# EAGLE design Dummy Bridge Board (EAGLE 7.3.0)
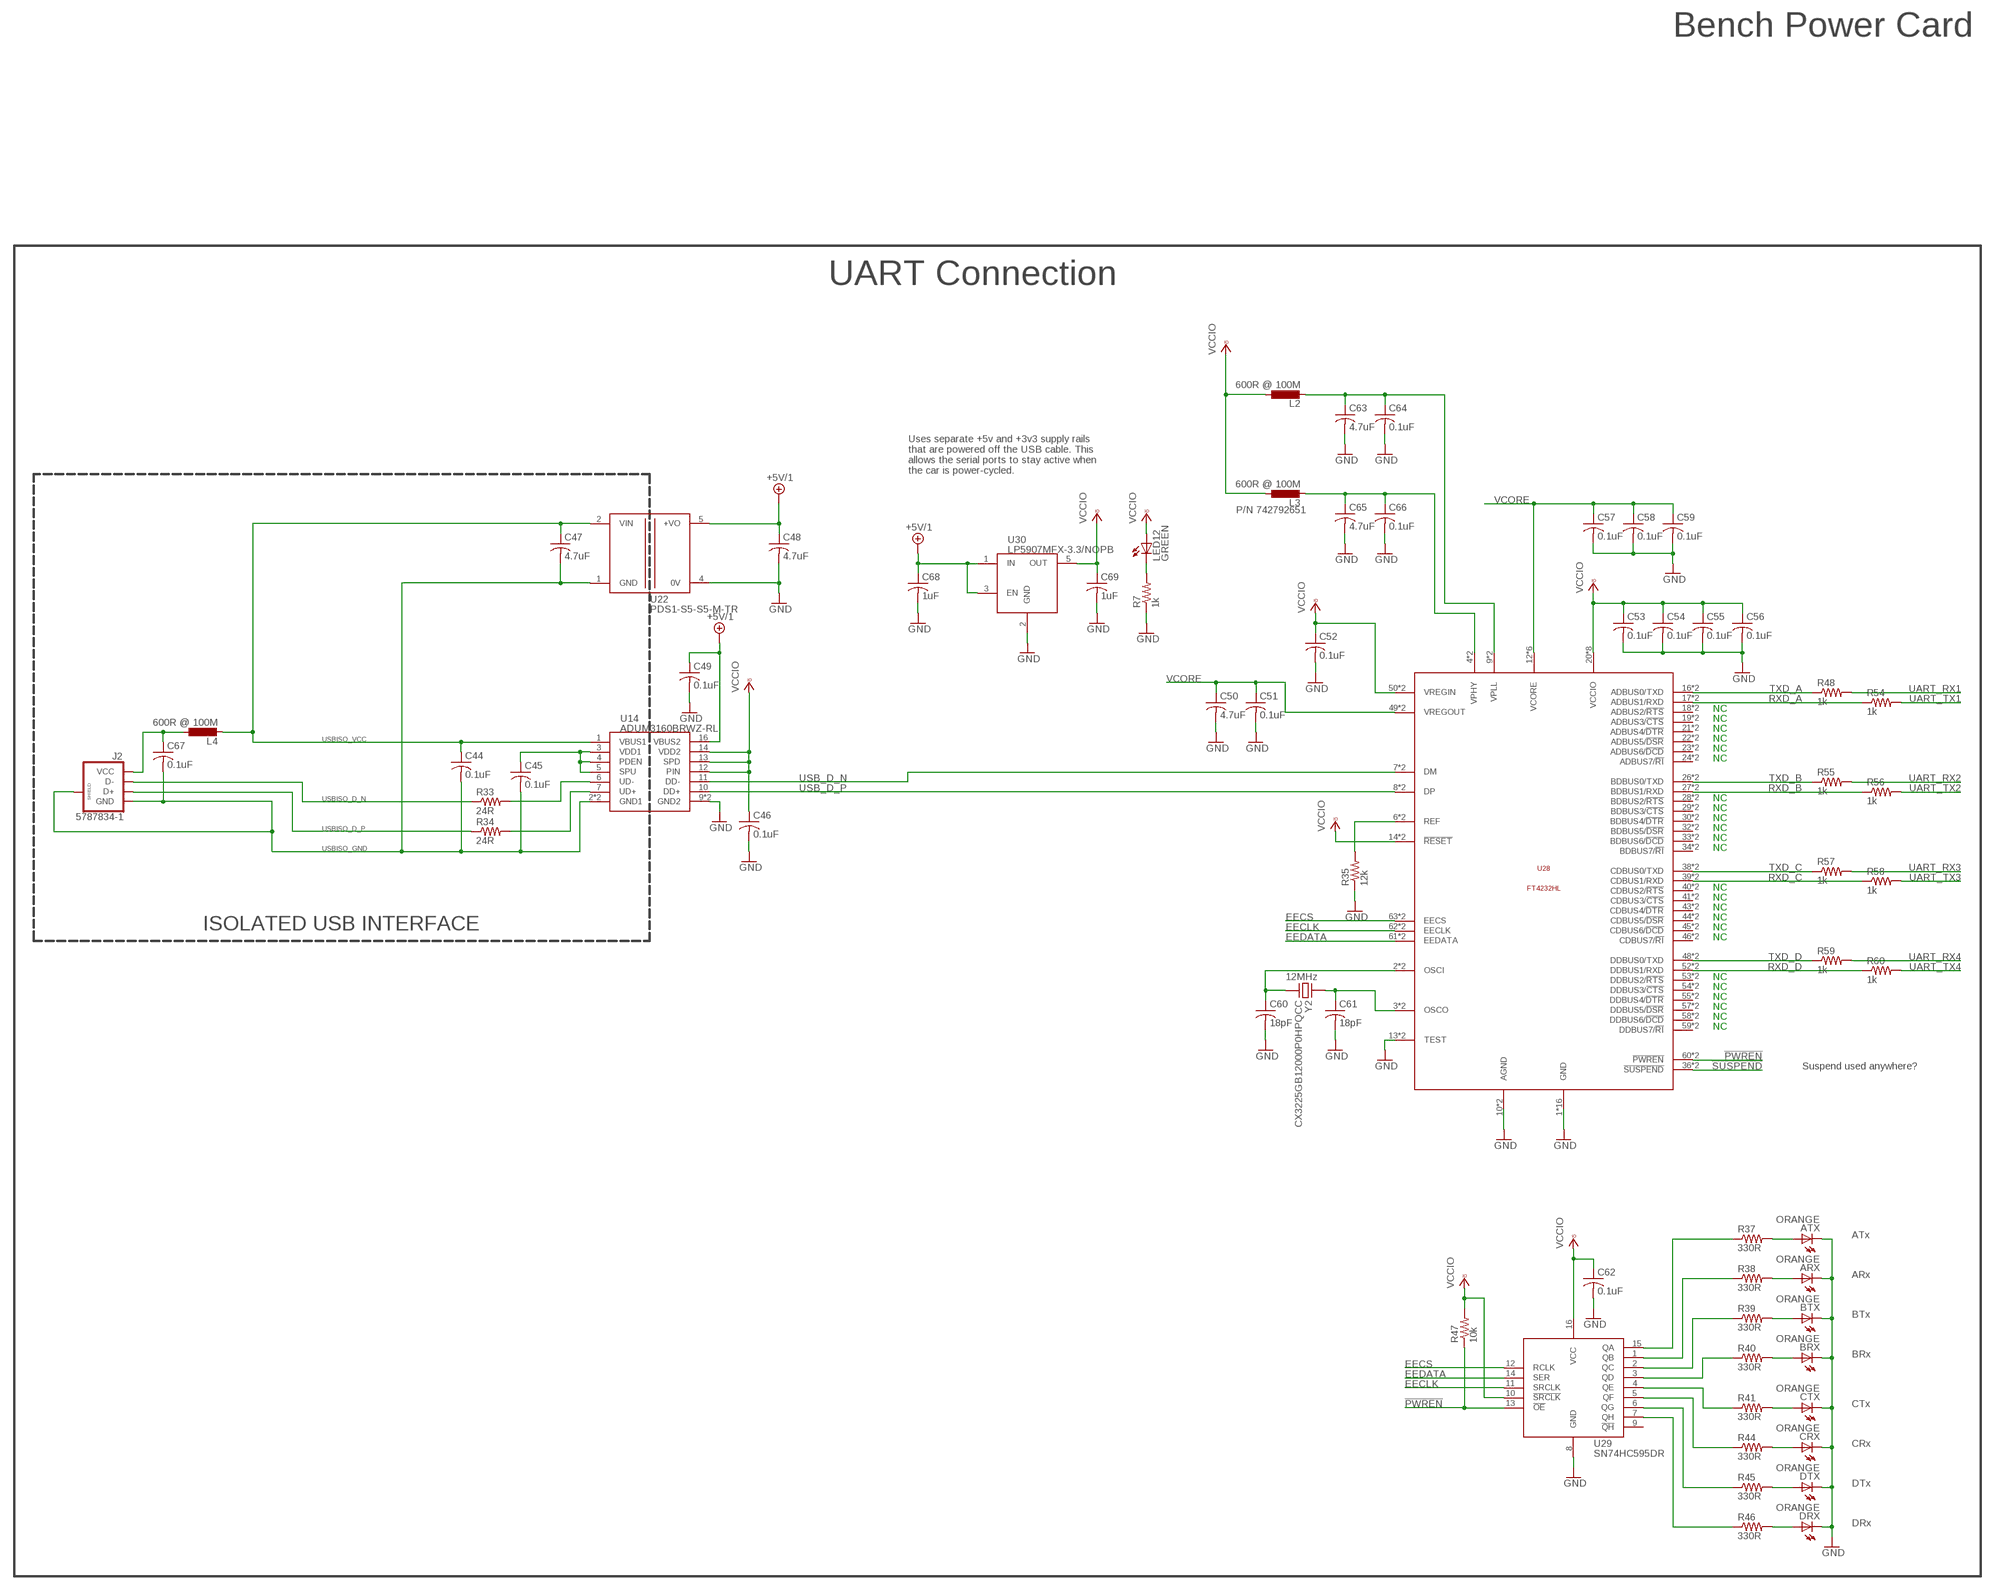
[diagram p0: schematic, sheet 1, part 1 of 2]
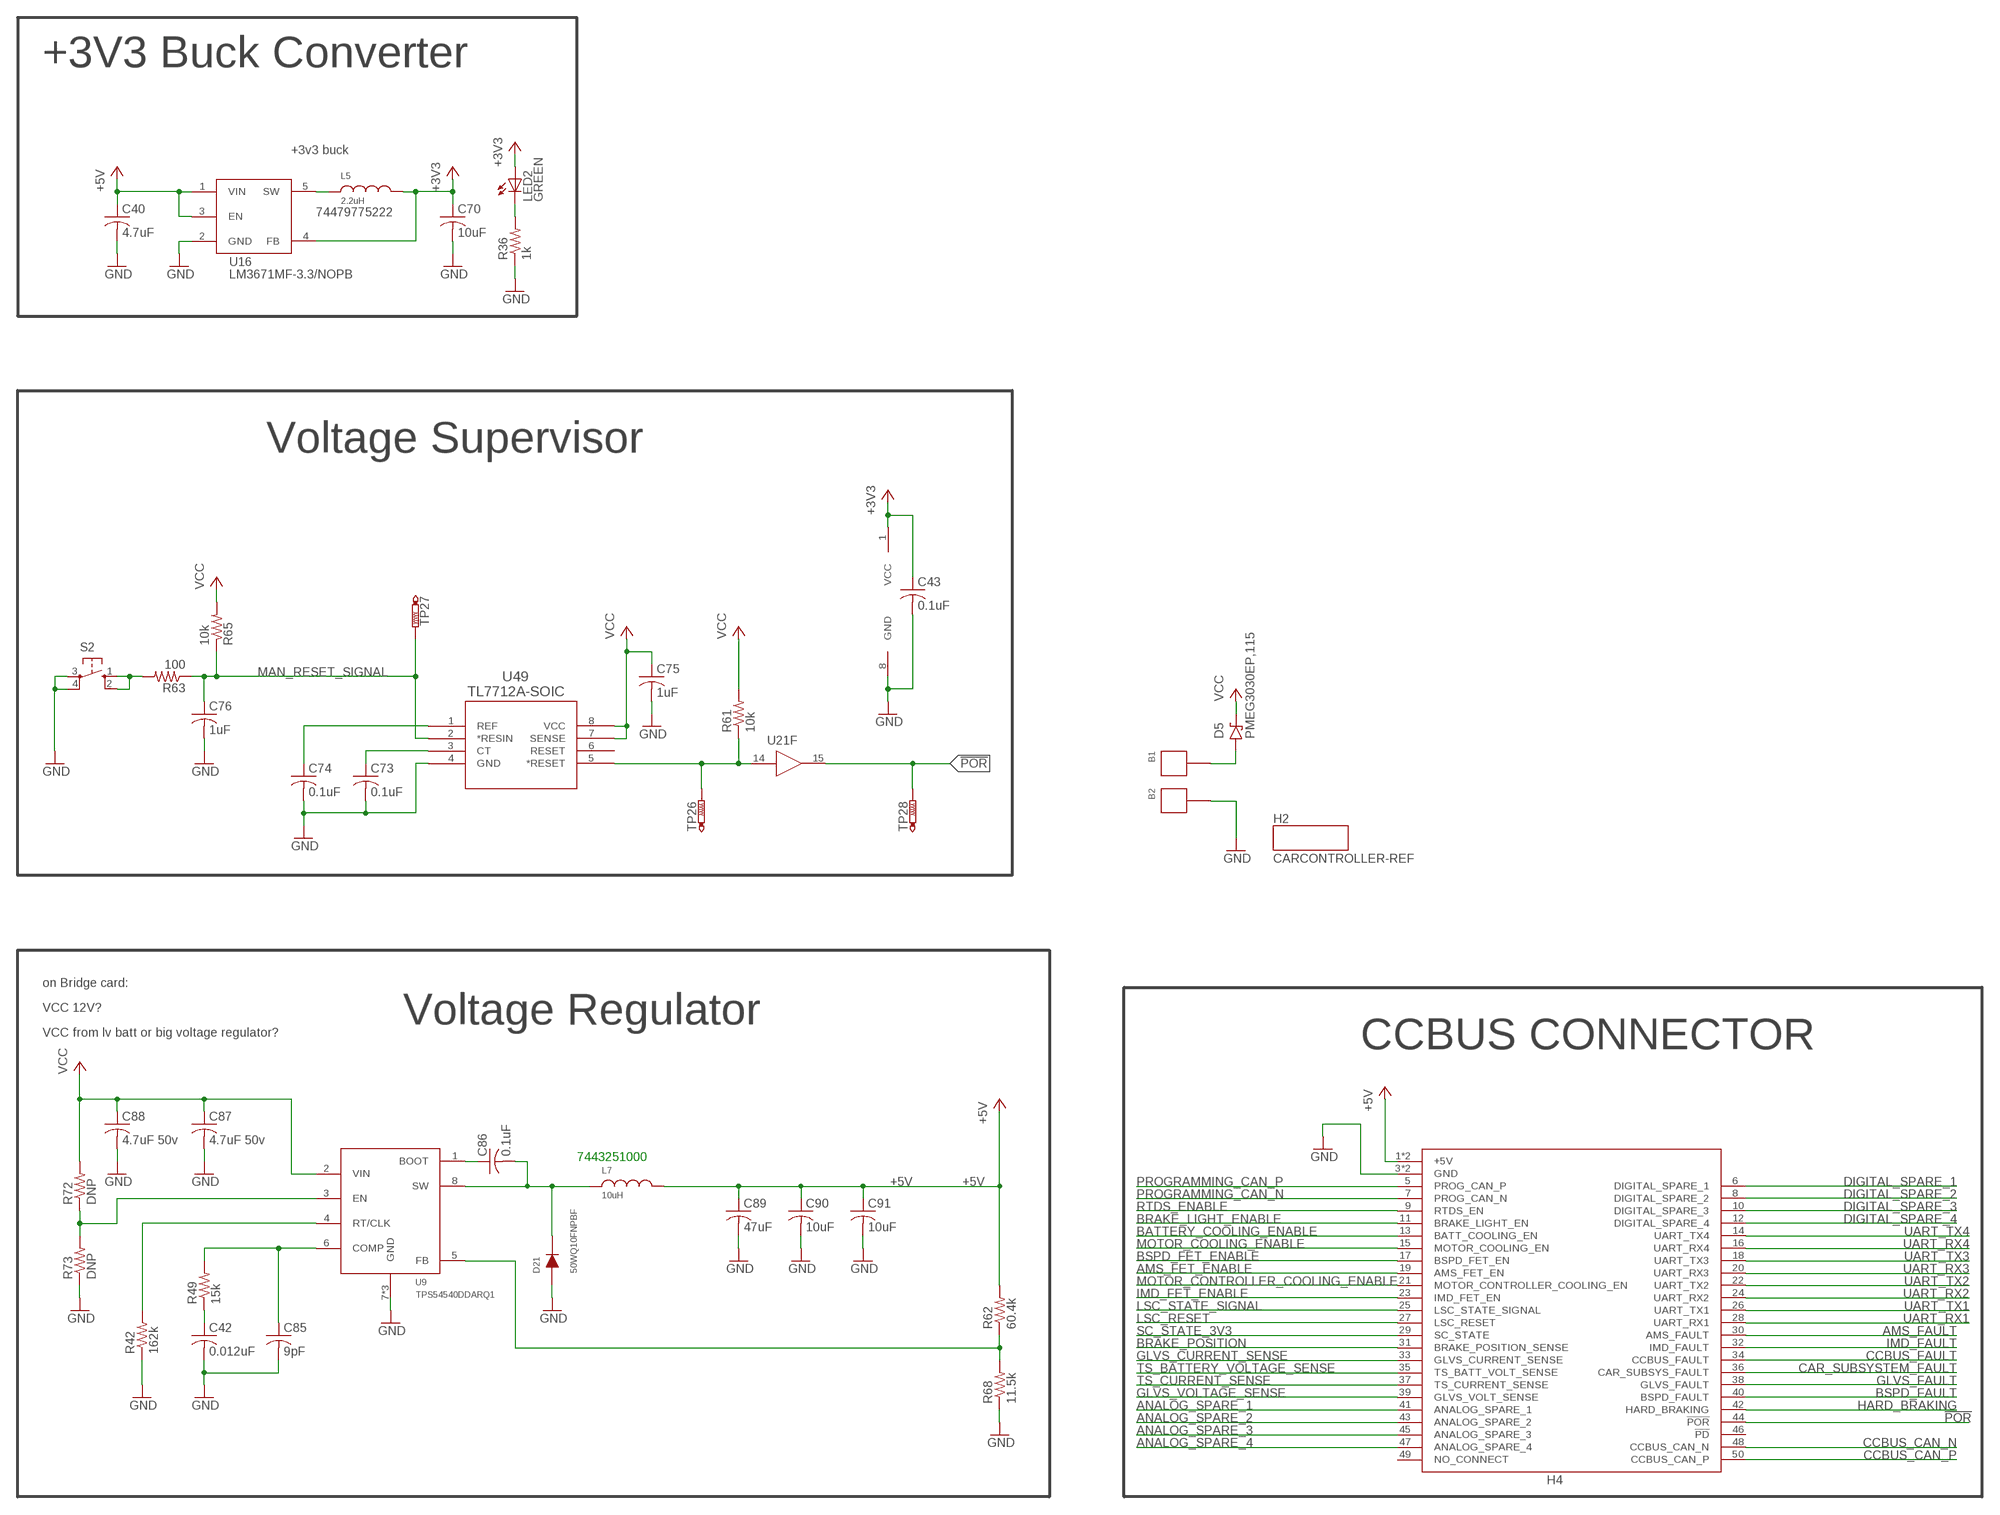
[diagram p1: schematic, sheet 1, part 2 of 2]

## Parts
ARX  ORANGE  LEDCHIP-LED0805  [CHIP-LED0805]
ATX  ORANGE  LEDCHIP-LED0805  [CHIP-LED0805]
B1  BKCT2228-2-ND  CT2228  [BANANA_SOCKET_VERT]
B2  BKCT2228-0-ND  CT2228  [BANANA_SOCKET_VERT]
BRX  ORANGE  LEDCHIP-LED0805  [CHIP-LED0805]
BTX  ORANGE  LEDCHIP-LED0805  [CHIP-LED0805]
C40  4.7uF  C-USC0603K  [C0603K]
C42  0.012uF  C-USC0603K  [C0603K]
C43  0.1uF  C-USC0603K  [C0603K]
C44  0.1uF  C-USC0603K  [C0603K]
C45  0.1uF  C-USC0603K  [C0603K]
C46  0.1uF  C-USC0603K  [C0603K]
C47  4.7uF  C-USC0603K  [C0603K]
C48  4.7uF  C-USC0603K  [C0603K]
C49  0.1uF  C-USC0603K  [C0603K]
C50  4.7uF  C-USC0603K  [C0603K]
C51  0.1uF  C-USC0603K  [C0603K]
C52  0.1uF  C-USC0603K  [C0603K]
C53  0.1uF  C-USC0603K  [C0603K]
C54  0.1uF  C-USC0603K  [C0603K]
C55  0.1uF  C-USC0603K  [C0603K]
C56  0.1uF  C-USC0603K  [C0603K]
C57  0.1uF  C-USC0603K  [C0603K]
C58  0.1uF  C-USC0603K  [C0603K]
C59  0.1uF  C-USC0603K  [C0603K]
C60  18pF  C-USC0603K  [C0603K]
C61  18pF  C-USC0603K  [C0603K]
C62  0.1uF  C-USC0603K  [C0603K]
C63  4.7uF  C-USC0603K  [C0603K]
C64  0.1uF  C-USC0603K  [C0603K]
C65  4.7uF  C-USC0603K  [C0603K]
C66  0.1uF  C-USC0603K  [C0603K]
C67  0.1uF  C-USC0603K  [C0603K]
C68  1uF  C-USC0603K  [C0603K]
C69  1uF  C-USC0603K  [C0603K]
C70  10uF  C-USC0603K  [C0603K]
C73  0.1uF  C-USC0603K  [C0603K]
C74  0.1uF  C-USC0603K  [C0603K]
C75  1uF  C-USC0603K  [C0603K]
C76  1uF  C-USC0603K  [C0603K]
C85  9pF  C-USC0603K  [C0603K]
C86  0.1uF  C-USC0603K  [C0603K]
C87  4.7uF 50v  C-USC1206  [C1206]
C88  4.7uF 50v  C-USC1206  [C1206]
C89  47uF  C-USC1206  [C1206]
C90  10uF  C-USC0603K  [C0603K]
C91  10uF  C-USC0603K  [C0603K]
CRX  ORANGE  LEDCHIP-LED0805  [CHIP-LED0805]
CTX  ORANGE  LEDCHIP-LED0805  [CHIP-LED0805]
D5  PMEG3030EP,115  [SOD-128]
D21  50WQ10FNPBF  VISHAY-50WQ10FNPBF  [DPAK]
DRX  ORANGE  LEDCHIP-LED0805  [CHIP-LED0805]
DTX  ORANGE  LEDCHIP-LED0805  [CHIP-LED0805]
H2  CARCONTROLLER-REF  [CARCONTROLLER-REF]
H4  CCBUS-STACK  [SAMTEC-TFM-125-XX-X-D]
J2  5787834-1  TE-USB-B-5787834-1  [TE-5787834-1]
L2  600R @ 100M  INDUCTOR  [0805]
L3  600R @ 100M  INDUCTOR  [0805]
L4  600R @ 100M  INDUCTOR  [0805]
L5  2.2uH  L0805  [0805]
L7  10uH  WURTH-744325XXXX  [WURTH-744325XXXX]
LED2  GREEN  LEDCHIP-LED0805  [CHIP-LED0805]
LED12  GREEN  LEDCHIP-LED0805  [CHIP-LED0805]
R7  1k  R-US_R0603  [R0603]
R33  24R  R-US_R0603  [R0603]
R34  24R  R-US_R0603  [R0603]
R35  12k  R-US_R0603  [R0603]
R36  1k  R-US_R0603  [R0603]
R37  330R  R-US_R0603  [R0603]
R38  330R  R-US_R0603  [R0603]
R39  330R  R-US_R0603  [R0603]
R40  330R  R-US_R0603  [R0603]
R41  330R  R-US_R0603  [R0603]
R42  162k  R-US_R0603  [R0603]
R44  330R  R-US_R0603  [R0603]
R45  330R  R-US_R0603  [R0603]
R46  330R  R-US_R0603  [R0603]
R47  10k  R-US_R0603  [R0603]
R48  1k  R-US_R0603  [R0603]
R49  15k  R-US_R0603  [R0603]
R54  1k  R-US_R0603  [R0603]
R55  1k  R-US_R0603  [R0603]
R56  1k  R-US_R0603  [R0603]
R57  1k  R-US_R0603  [R0603]
R58  1k  R-US_R0603  [R0603]
R59  1k  R-US_R0603  [R0603]
R60  1k  R-US_R0603  [R0603]
R61  10k  R-US_R0603  [R0603]
R62  60.4k  R-US_R0603  [R0603]
R63  100  R-US_R0603  [R0603]
R65  10k  R-US_R0603  [R0603]
R68  11.5k  R-US_R0603  [R0603]
R72  DNP  R-US_R0603  [R0603]
R73  DNP  R-US_R0603  [R0603]
S2  TE-FSM4JSMATR  [TE-FSM4JSMATR]
TP26  PTR1TP20R  [TP20R]
TP27  PTR1TP20R  [TP20R]
TP28  PTR1TP20R  [TP20R]
U9  TPS54540DDARQ1  TPS54540  [TPS54540]
U14  ADUM3160BRWZ-RL  ADUM3160  [ADUM3160]
U16  LM3671MF-3.3/NOPB  LM3671MF  [SOT23-5]
U21  CD4050BD  [SOIC-16]
U22  PDS1-S5-S5-M-TR  PDS1-M  [PDS1-M]
U28  FT4232HL  [PQFP-64]
U29  SN74HC595DR  SN74HC595D  [SOIC-16]
U30  LP5907MFX-3.3/NOPB  LP5907MFX  [SOT23-5]
U49  TL7712A-SOIC  TL7709A-SOIC  [D8]
Y2  CX3225GB12000P0HPQCC  CX3225GB  [CX3225GB]

## Nets
5VREG_EN: R72.1 R73.2 U9.3(EN)
!POR: H4.44(!POR!) TP28.TP U21.15(F:OUT)
!PWREN!: R47.1 U28.60(!PWREN!) U28.MASK-60(!PWREN!) U29.13(!OE!)
!SUSPEND!: U28.36(!SUSPEND!) U28.MASK-36(!SUSPEND!)
+3V3: C43.1 C70.1 L5.2 LED2.A U16.4(FB) U21.1(POWER:VCC)
+5V: C40.1 C89.1 C90.1 C91.1 H4.1(+5V) H4.2(+5V) L7.P$2 R62.2 U16.1(VIN) U16.3(EN)
+5V/1: C48.1 C49.1 C68.1 U14.16(VBUS2) U22.5(+VO) U30.1(IN) U30.3(EN)
AMS_FAULT: H4.30(AMS_FAULT)
AMS_FET_ENABLE: H4.19(AMS_FET_EN)
ANALOG_SPARE_1: H4.41(ANALOG_SPARE_1)
ANALOG_SPARE_2: H4.43(ANALOG_SPARE_2)
ANALOG_SPARE_3: H4.45(ANALOG_SPARE_3)
ANALOG_SPARE_4: H4.47(ANALOG_SPARE_4)
BATTERY_COOLING_ENABLE: H4.13(BATT_COOLING_EN)
BOOT_5V: C86.1 U9.1(BOOT)
BRAKE_LIGHT_ENABLE: H4.11(BRAKE_LIGHT_EN)
BRAKE_POSITION [analog]: H4.31(BRAKE_POSITION_SENSE)
BSPD_FAULT: H4.40(BSPD_FAULT)
BSPD_FET_ENABLE: H4.17(BSPD_FET_EN)
CAR_SUBSYSTEM_FAULT: H4.36(CAR_SUBSYS_FAULT)
CCBUS_CAN_N [diffPairs]: H4.48(CCBUS_CAN_N)
CCBUS_CAN_P [diffPairs]: H4.50(CCBUS_CAN_P)
CCBUS_FAULT: H4.34(CCBUS_FAULT)
COMP_5V: C85.1 R49.2 U9.6(COMP)
DIGITAL_SPARE_1: H4.6(DIGITAL_SPARE_1)
DIGITAL_SPARE_2: H4.8(DIGITAL_SPARE_2)
DIGITAL_SPARE_3: H4.10(DIGITAL_SPARE_3)
DIGITAL_SPARE_4: H4.12(DIGITAL_SPARE_4)
EECLK: U28.62(EECLK) U28.MASK-62(EECLK) U29.11(SRCLK)
EECS: U28.63(EECS) U28.MASK-63(EECS) U29.12(RCLK)
EEDATA: U28.61(EEDATA) U28.MASK-61(EEDATA) U29.14(SER)
FB_5V: R62.1 R68.2 U9.5(FB)
GLVS_CURRENT_SENSE: H4.33(GLVS_CURRENT_SENSE)
GLVS_FAULT: H4.38(GLVS_FAULT)
GLVS_VOLTAGE_SENSE [analog]: H4.39(GLVS_VOLT_SENSE)
GND: ARX.C ATX.C B2.P$1 BRX.C BTX.C C40.2 C42.2 C43.2 C46.2 C48.2 C49.2 C50.2 C51.2 C52.2 C53.2 C54.2 C55.2 C56.2 C57.2 C58.2 C59.2 C60.2 C61.2 C62.2 C63.2 C64.2 C65.2 C66.2 C68.2 C69.2 C70.2 C73.2 C74.2 C75.2 C76.2 C85.2 C87.2 C88.2 C89.2 C90.2 C91.2 CRX.C CTX.C D21.1(ANODE) D21.3(ANODE) DRX.C DTX.C H4.3(GND) H4.4(GND) R7.1 R35.1 R36.1 R42.1 R68.1 R73.1 S2.3 S2.4 U9.7(GND) U9.PAD1(GND) U9.PAD(GND) U14.9(GND2) U14.15(GND2) U16.2(GND) U21.8(POWER:GND) U22.4(0V) U28.1(GND) U28.5(GND) U28.10(AGND) U28.11(GND) U28.13(TEST) U28.15(GND) U28.25(GND) U28.35(GND) U28.47(GND) U28.51(GND) U28.MASK-1(GND) U28.MASK-5(GND) U28.MASK-10(AGND) U28.MASK-11(GND) U28.MASK-13(TEST) U28.MASK-15(GND) U28.MASK-25(GND) U28.MASK-35(GND) U28.MASK-47(GND) U28.MASK-51(GND) U29.8(GND) U30.2(GND) U49.4(GND)
HARD_BRAKING: H4.42(HARD_BRAKING)
IMD_FAULT: H4.32(IMD_FAULT)
IMD_FET_ENABLE: H4.23(IMD_FET_EN)
LSC_RESET: H4.27(LSC_RESET)
LSC_STATE_SIGNAL: H4.25(LSC_STATE_SIGNAL)
MAN_RESET_SIGNAL: C76.1 R63.1 R65.1 TP27.TP U49.2(*RESIN)
MOTOR_CONTROLLER_COOLING_ENABLE: H4.21(MOTOR_CONTROLLER_COOLING_EN)
MOTOR_COOLING_ENABLE: H4.15(MOTOR_COOLING_EN)
N$2: B1.P$1 D5.ANODE(A)
N$4: LED12.C R7.2
N$17: C42.1 R49.1
N$32: R40.1 U29.3(QD)
N$47: R41.1 U29.4(QE)
N$49: R39.1 U29.2(QC)
N$50: R38.1 U29.1(QB)
N$52: R37.1 U29.15(QA)
N$55: R44.1 U29.5(QF)
N$56: LED2.C R36.2
N$57: L5.1 U16.5(SW)
N$60: R61.1 TP26.TP U21.14(F:IN) U49.5(*RESET)
N$61: R45.1 U29.6(QG)
N$62: R46.1 U29.7(QH)
N$63: ATX.A R37.2
N$64: ARX.A R38.2
N$65: BTX.A R39.2
N$66: BRX.A R40.2
N$67: CTX.A R41.2
N$68: CRX.A R44.2
N$69: DTX.A R45.2
N$70: DRX.A R46.2
N$71: C67.1 J2.1(VCC) L4.1
N$72: C74.1 U49.1(REF)
N$73: C73.1 U49.3(CT)
N$74: R63.2 S2.1 S2.2
OSCI: C60.1 U28.2(OSCI) U28.MASK-2(OSCI) Y2.3
OSCO: C61.1 U28.3(OSCO) U28.MASK-3(OSCO) Y2.1
PROGRAMMING_CAN_N: H4.7(PROG_CAN_N)
PROGRAMMING_CAN_P: H4.5(PROG_CAN_P)
REF: R35.2 U28.6(REF) U28.MASK-6(REF)
RT_5V: R42.2 U9.4(RT/CLK)
RTDS_ENABLE: H4.9(RTDS_EN)
RXD_A: R54.1 U28.17(ADBUS1/RXD) U28.MASK-17(ADBUS1/RXD)
RXD_B: R56.1 U28.27(BDBUS1/RXD) U28.MASK-27(BDBUS1/RXD)
RXD_C: R58.1 U28.39(CDBUS1/RXD) U28.MASK-39(CDBUS1/RXD)
RXD_D: R60.1 U28.52(DDBUS1/RXD) U28.MASK-52(DDBUS1/RXD)
SC_STATE_3V3: H4.29(SC_STATE)
SW_5V: C86.2 D21.2(CATHODE) L7.P$1 U9.8(SW)
TS_BATTERY_VOLTAGE_SENSE: H4.35(TS_BATT_VOLT_SENSE)
TS_CURRENT_SENSE [analog]: H4.37(TS_CURRENT_SENSE)
TXD_A: R48.1 U28.16(ADBUS0/TXD) U28.MASK-16(ADBUS0/TXD)
TXD_B: R55.1 U28.26(BDBUS0/TXD) U28.MASK-26(BDBUS0/TXD)
TXD_C: R57.1 U28.38(CDBUS0/TXD) U28.MASK-38(CDBUS0/TXD)
TXD_D: R59.1 U28.48(DDBUS0/TXD) U28.MASK-48(DDBUS0/TXD)
UART_RX1: H4.28(UART_RX1) R48.2
UART_RX2: H4.24(UART_RX2) R55.2
UART_RX3: H4.20(UART_RX3) R57.2
UART_RX4: H4.16(UART_RX4) R59.2
UART_TX1: H4.26(UART_TX1) R54.2
UART_TX2: H4.22(UART_TX2) R56.2
UART_TX3: H4.18(UART_TX3) R58.2
UART_TX4: H4.14(UART_TX4) R60.2
UD_N [USB]: R33.2 U14.6(UD-)
UD_P [USB]: R34.2 U14.7(UD+)
USB_D_N [USB]: U14.11(DD-) U28.7(DM) U28.MASK-7(DM)
USB_D_P [USB]: U14.10(DD+) U28.8(DP) U28.MASK-8(DP)
USBISO_D_N [USB]: J2.2(D-) R33.1
USBISO_D_P [USB]: J2.3(D+) R34.1
USBISO_GND: C44.2 C45.2 C47.2 C67.2 J2.4(GND) J2.SH1(SHIELD) J2.SH2(SHIELD) U14.2(GND1) U14.8(GND1) U22.1(GND)
USBISO_VCC: C44.1 C47.1 L4.2 U14.1(VBUS1) U22.2(VIN)
VCC: C75.1 C87.1 C88.1 D5.CATHODE(K) R61.2 R65.2 R72.2 U9.2(VIN) U49.7(SENSE) U49.8(VCC)
VCCIO: C46.1 C52.1 C53.1 C54.1 C55.1 C56.1 C62.1 C69.1 L2.1 L3.1 LED12.A R47.2 U14.12(PIN) U14.13(SPD) U14.14(VDD2) U28.14(!RESET!) U28.20(VCCIO) U28.31(VCCIO) U28.42(VCCIO) U28.50(VREGIN) U28.56(VCCIO) U28.MASK-14(!RESET!) U28.MASK-20(VCCIO) U28.MASK-31(VCCIO) U28.MASK-42(VCCIO) U28.MASK-50(VREGIN) U28.MASK-56(VCCIO) U29.10(!SRCLK!) U29.16(VCC) U30.5(OUT)
VCORE: C50.1 C51.1 C57.1 C58.1 C59.1 U28.12(VCORE) U28.37(VCORE) U28.49(VREGOUT) U28.64(VCORE) U28.MASK-12(VCORE) U28.MASK-37(VCORE) U28.MASK-49(VREGOUT) U28.MASK-64(VCORE)
VDD1: C45.1 U14.3(VDD1) U14.4(PDEN) U14.5(SPU)
VPHY: C65.1 C66.1 L3.2 U28.4(VPHY) U28.MASK-4(VPHY)
VPLL: C63.1 C64.1 L2.2 U28.9(VPLL) U28.MASK-9(VPLL)
Unconnected: H4.46(!PD!) H4.49(NO_CONNECT) U21.2(A:OUT) U21.3(A:IN) U21.4(B:OUT) U21.5(B:IN) U21.6(C:OUT) U21.7(C:IN) U21.9(D:IN) U21.10(D:OUT) U21.11(E:IN) U21.12(E:OUT) U28.18(ADBUS2/!RTS!) U28.19(ADBUS3/!CTS!) U28.21(ADBUS4/!DTR!) U28.22(ADBUS5/!DSR!) U28.23(ADBUS6/!DCD!) U28.24(ADBUS7/!RI!) U28.28(BDBUS2/!RTS!) U28.29(BDBUS3/!CTS!) U28.30(BDBUS4/!DTR!) U28.32(BDBUS5/!DSR!) U28.33(BDBUS6/!DCD!) U28.34(BDBUS7/!RI!) U28.40(CDBUS2/!RTS!) U28.41(CDBUS3/!CTS!) U28.43(CDBUS4/!DTR!) U28.44(CDBUS5/!DSR!) U28.45(CDBUS6/!DCD!) U28.46(CDBUS7/!RI!) U28.53(DDBUS2/!RTS!) U28.54(DDBUS3/!CTS!) U28.55(DDBUS4/!DTR!) U28.57(DDBUS5/!DSR!) U28.58(DDBUS6/!DCD!) U28.59(DDBUS7/!RI!) U28.MASK-18(ADBUS2/!RTS!) U28.MASK-19(ADBUS3/!CTS!) U28.MASK-21(ADBUS4/!DTR!) U28.MASK-22(ADBUS5/!DSR!) U28.MASK-23(ADBUS6/!DCD!) U28.MASK-24(ADBUS7/!RI!) U28.MASK-28(BDBUS2/!RTS!) U28.MASK-29(BDBUS3/!CTS!) U28.MASK-30(BDBUS4/!DTR!) U28.MASK-32(BDBUS5/!DSR!) U28.MASK-33(BDBUS6/!DCD!) U28.MASK-34(BDBUS7/!RI!) U28.MASK-40(CDBUS2/!RTS!) U28.MASK-41(CDBUS3/!CTS!) U28.MASK-43(CDBUS4/!DTR!) U28.MASK-44(CDBUS5/!DSR!) U28.MASK-45(CDBUS6/!DCD!) U28.MASK-46(CDBUS7/!RI!) U28.MASK-53(DDBUS2/!RTS!) U28.MASK-54(DDBUS3/!CTS!) U28.MASK-55(DDBUS4/!DTR!) U28.MASK-57(DDBUS5/!DSR!) U28.MASK-58(DDBUS6/!DCD!) U28.MASK-59(DDBUS7/!RI!) U29.9(!QH!) U49.6(RESET)

## Notes on the sheet
- Bench Power Card
- UART Connection
- +3V3 Buck Converter
- Uses separate +5v and +3v3 supply rails
  that are powered off the USB cable. This
  allows the serial ports to stay active when
  the car is power-cycled.
- +3v3 buck
- P/N 742792651
- 74479775222
- NC
- NC
- NC
- NC | Voltage Supervisor
- NC
- NC
- NC
- NC
- NC
- NC
- NC
- NC
- NC
- NC
- NC
- NC
- ISOLATED USB INTERFACE | NC
- NC
- 12MHz | NC
- NC
- NC
- NC
- NC
- NC
- Suspend used anywhere?
- on Bridge card:
- VCC 12V?
- Voltage Regulator
- VCC from lv batt or big voltage regulator?
- CCBUS CONNECTOR
- ATx
- ARx
- 7443251000
- BTx
- BRx
- CTx
- CRx
- DTx
- DRx

## Library data of the parts
ARX ATX BRX BTX CRX CTX DRX DTX = FormE:LED: LED OSRAM: - CHIPLED LG R971, LG N971, LY N971, LG Q971, LY Q971, LO R971, LY R971 LH N974, LH R974 LS Q976, LO Q976, LY Q976 LO Q996 - Hyper CHIPLED LW Q18S LB Q993, LB Q99A, LB R99A - SideLED LS A670, LO A670, LY A670, LG A670, LP A670 LB A673, LV A673, LT A673, LW A673 LH A674 LY A675 LS A676, LA A676, LO A676, LY A676, LW A676 LS A679, LY A679, LG A679 - Hyper Micro SIDELED® LS Y876, LA Y876, LO Y876, LY Y876 LT Y87S - SmartLED LW L88C, LW L88S LB L89C, LB L89S, LG L890 LS L89K, LO L89K, LY L89K LS L896, LA L896, LO L896, LY L896 - TOPLED LS T670, LO T670, LY T670, LG T670, LP T670 LSG T670, LSP T670, LSY T670, LOP T670, LYG T670 LG T671, LOG T671, LSG T671 LB T673, LV T673, LT T673, LW T673 LH T674 LS T676, LA T676, LO T676, LY T676, LB T676, LH T676, LSB T676, LW T676 LB T67C, LV T67C, LT T67C, LS T67K, LO T67K, LY T67K, LW E67C LS E67B, LA E67B, LO E67B, LY E67B, LB E67C, LV E67C, LT E67C LW T67C LS T679, LY T679, LG T679 LS T770, LO T770, LY T770, LG T770, LP T770 LB T773, LV T773, LT T773, LW T773 LH T774 LS E675, LA E675, LY E675, LS T675 LS T776, LA T776, LO T776, LY T776, LB T776 LHGB T686 LT T68C, LB T68C - Hyper Mini TOPLED® LB M676 - Mini TOPLED Santana® LG M470 LS M47K, LO M47K, LY M47K Source: http://www.osram.convergy.de/; PARTNO: 598-8130-107F
B1 = FormE:CT2228: BANANA SOCKET VERT; PARTNO: CT2228-2
B2 = FormE:CT2228: BANANA SOCKET VERT; PARTNO: CT2228-0
C40 = rcl:C-US: CAPACITOR, American symbol; PARTNO: GRM188R61A475KE15D
C42 = rcl:C-US: CAPACITOR, American symbol; PARTNO: GRM188R71H123KA01D
C43-C46 C49 C51-C59 C62 C64 C66-C69 C75 C76 C86 = rcl:C-US: CAPACITOR, American symbol; PARTNO: GRM188R71E104KA01D
C47 C48 C50 C63 C65 = rcl:C-US: CAPACITOR, American symbol; PARTNO: GRM188R61C475KAAJD
C60 C61 = rcl:C-US: CAPACITOR, American symbol; PARTNO: GRM1885C1H180JA01D
C70 C90 C91 = rcl:C-US: CAPACITOR, American symbol; PARTNO: EMK107BBJ106MA-T
C73 C74 = rcl:C-US: CAPACITOR, American symbol; MPN: C2012X7R1H104K085AA; OC_NEWARK: 04X3288; PARTNO: GRM188R71E104KA01D
C85 = rcl:C-US: CAPACITOR, American symbol; PARTNO: GRM1885C1H9R0DA01D
C87 C88 = rcl:C-US: CAPACITOR, American symbol; PARTNO: GRM31CR71H475KA12L
C89 = rcl:C-US: CAPACITOR, American symbol; PARTNO: GRM31CR61A476ME15L
D5 = FormE:PMEG3030EP,115; PARTNO: PMEG3030EP,115
D21 = FormE:VISHAY-50WQ10FNPBF; PARTNO: VS-50WQ10FNPBF
H2 = FormE:CARCONTROLLER-REF
H4 = FormE:CCBUS-STACK
J2 = FormE:TE-USB-B-5787834-1; PARTNO: 5787834-1; VALUE: 5787834-1
L2-L4 = launchpad:INDUCTOR; PARTNO: BLM21AG601SN1D
L5 = FormE:L0805; PARTNO: 74479775222
L7 = FormE:WURTH-744325XXXX; PARTNO: 7443251000
LED2 LED12 = FormE:LED: LED OSRAM: - CHIPLED LG R971, LG N971, LY N971, LG Q971, LY Q971, LO R971, LY R971 LH N974, LH R974 LS Q976, LO Q976, LY Q976 LO Q996 - Hyper CHIPLED LW Q18S LB Q993, LB Q99A, LB R99A - SideLED LS A670, LO A670, LY A670, LG A670, LP A670 LB A673, LV A673, LT A673, LW A673 LH A674 LY A675 LS A676, LA A676, LO A676, LY A676, LW A676 LS A679, LY A679, LG A679 - Hyper Micro SIDELED® LS Y876, LA Y876, LO Y876, LY Y876 LT Y87S - SmartLED LW L88C, LW L88S LB L89C, LB L89S, LG L890 LS L89K, LO L89K, LY L89K LS L896, LA L896, LO L896, LY L896 - TOPLED LS T670, LO T670, LY T670, LG T670, LP T670 LSG T670, LSP T670, LSY T670, LOP T670, LYG T670 LG T671, LOG T671, LSG T671 LB T673, LV T673, LT T673, LW T673 LH T674 LS T676, LA T676, LO T676, LY T676, LB T676, LH T676, LSB T676, LW T676 LB T67C, LV T67C, LT T67C, LS T67K, LO T67K, LY T67K, LW E67C LS E67B, LA E67B, LO E67B, LY E67B, LB E67C, LV E67C, LT E67C LW T67C LS T679, LY T679, LG T679 LS T770, LO T770, LY T770, LG T770, LP T770 LB T773, LV T773, LT T773, LW T773 LH T774 LS E675, LA E675, LY E675, LS T675 LS T776, LA T776, LO T776, LY T776, LB T776 LHGB T686 LT T68C, LB T68C - Hyper Mini TOPLED® LB M676 - Mini TOPLED Santana® LG M470 LS M47K, LO M47K, LY M47K Source: http://www.osram.convergy.de/; PARTNO: 598-8170-107F
R7 R36 R48 R54-R60 = rcl:R-US_: RESISTOR, American symbol; PARTNO: ERJ-3EKF1001V
R33 R34 = rcl:R-US_: RESISTOR, American symbol; PARTNO: ERJ-3EKF24R0V
R35 = rcl:R-US_: RESISTOR, American symbol; PARTNO: ERJ-3EKF1202V
R37-R41 R44-R46 = rcl:R-US_: RESISTOR, American symbol; PARTNO: ERJ-3EKF3300V
R42 = rcl:R-US_: RESISTOR, American symbol; PARTNO: ERJ-3EKF1623V
R47 R61 R65 = rcl:R-US_: RESISTOR, American symbol; PARTNO: ERJ-3EKF1002V
R49 = rcl:R-US_: RESISTOR, American symbol; PARTNO: ERJ-3EKF1502V
R62 = rcl:R-US_: RESISTOR, American symbol; PARTNO: ERJ-3EKF6042V
R63 = rcl:R-US_: RESISTOR, American symbol; PARTNO: ERJ-3EKF1000V
R68 = rcl:R-US_: RESISTOR, American symbol; PARTNO: ERJ-3EKF1152V
R72 R73 = rcl:R-US_: RESISTOR, American symbol; PARTNO: *
S2 = FormE:TE-FSM4JSMATR; PARTNO: FSM4JSMATR
TP26-TP28 = testpad:PTR1: TEST PIN
U9 = FormE:TPS54540; PARTNO: TPS54540DDAR
U14 = FormE:ADUM3160; PARTNO: ADUM3160BRWZ-RL
U16 = FormE:LM3671; PARTNO: LM3671MF-3.3/NOPB
U21 = FormE:CD4050B; PARTNO: CD4050BDR
U22 = FormE:PDS1-M; PARTNO: PDS1-S5-S5-M-TR
U28 = FormE:FT4232H; PARTNO: FT4232HL-REEL
U29 = FormE:SN74HC595; PARTNO: SN74HC595DR
U30 = FormE:LP5907; PARTNO: LP5907MFX-3.3/NOPB
U49 = FormE:TL7709A; DATASHEETURL: http://www.ti.com/lit/gpn/TL7709A; DESCRIPTION: Single Supply Voltage Supervisor ror 5V Systems with Programmable Time Delay; FAMILY_NAME: SUPERVISOR AND RESET IC; GENERIC_PART_NUMBER: TL7709A; INDUSTRY_STD_PKG_TYPE: SOIC; MANUFACTURER: Texas Instruments; MANUFACTURER_PART_NUMBER: tl7705b_d_8; MPN: TL7705BID; OC_NEWARK: 96W3363; PACKAGE_DESIGNATOR: D; PARTNO: TL7712ACDR; PIN_COUNT: 8; VENDOR: Texas Instruments
Y2 = FormE:CX3225GB; PARTNO: CX3225GB12000P0HPQCC

## Net classes
1 diffPairs: width 0.254 mm, drill 0.5 mm, clearance 0.254 mm
2 analog: width 0.152 mm, drill 0.5 mm, clearance 0.127 mm
3 USB: width 0.254 mm, clearance 0.254 mm

## Board
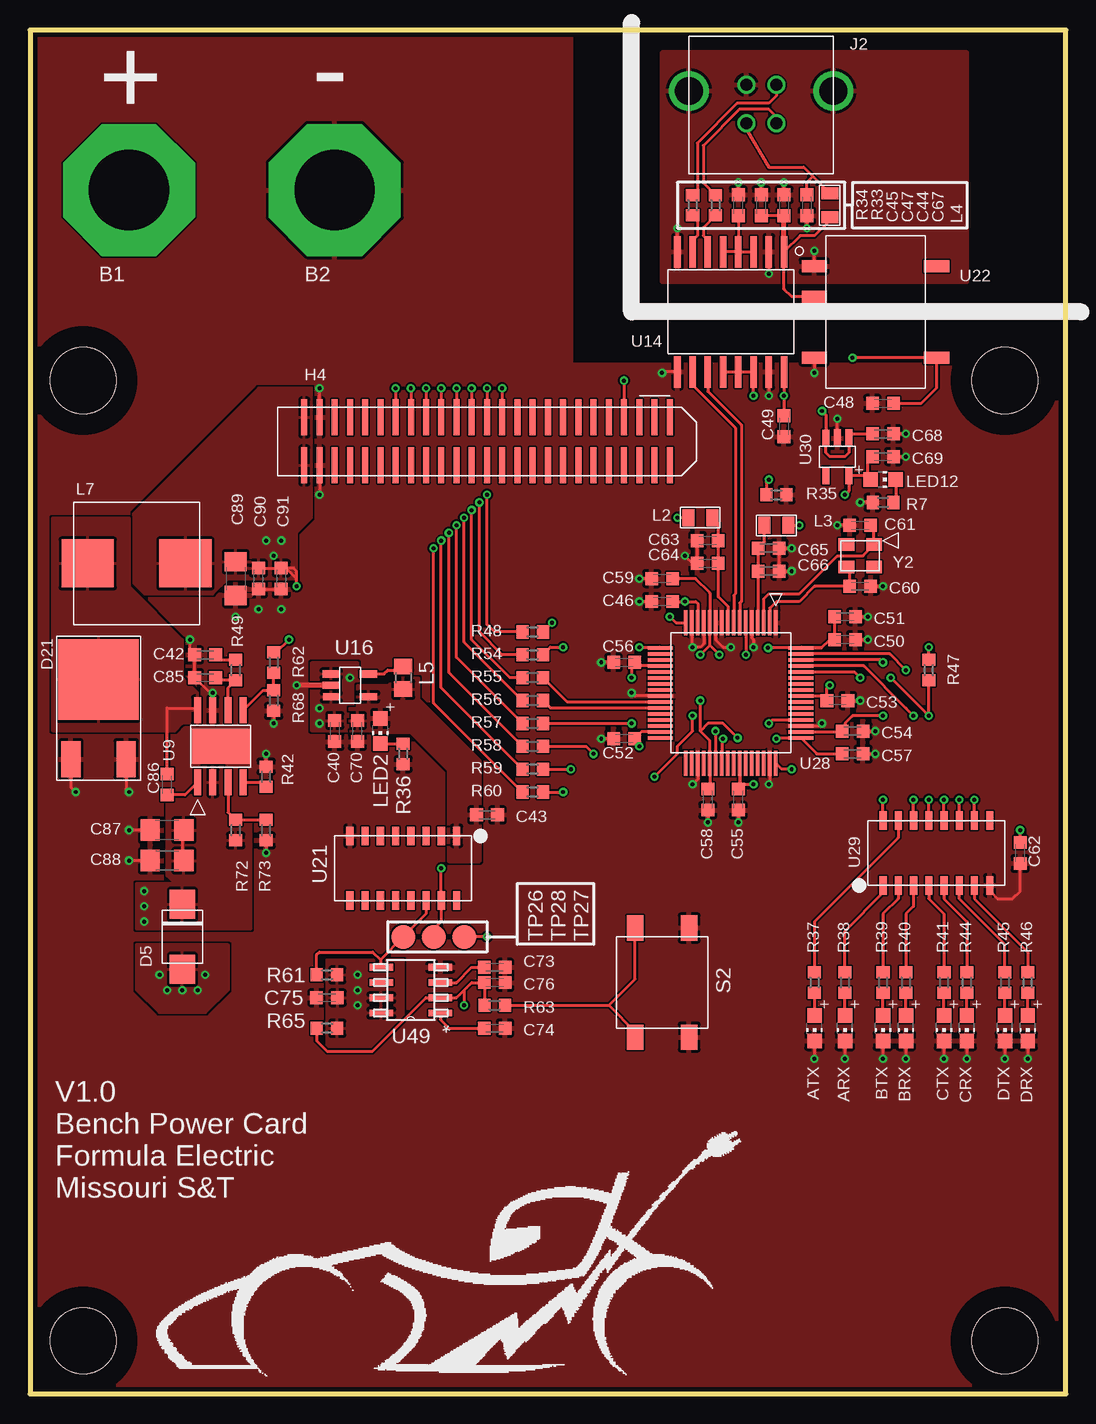
[diagram p2: board, top side]
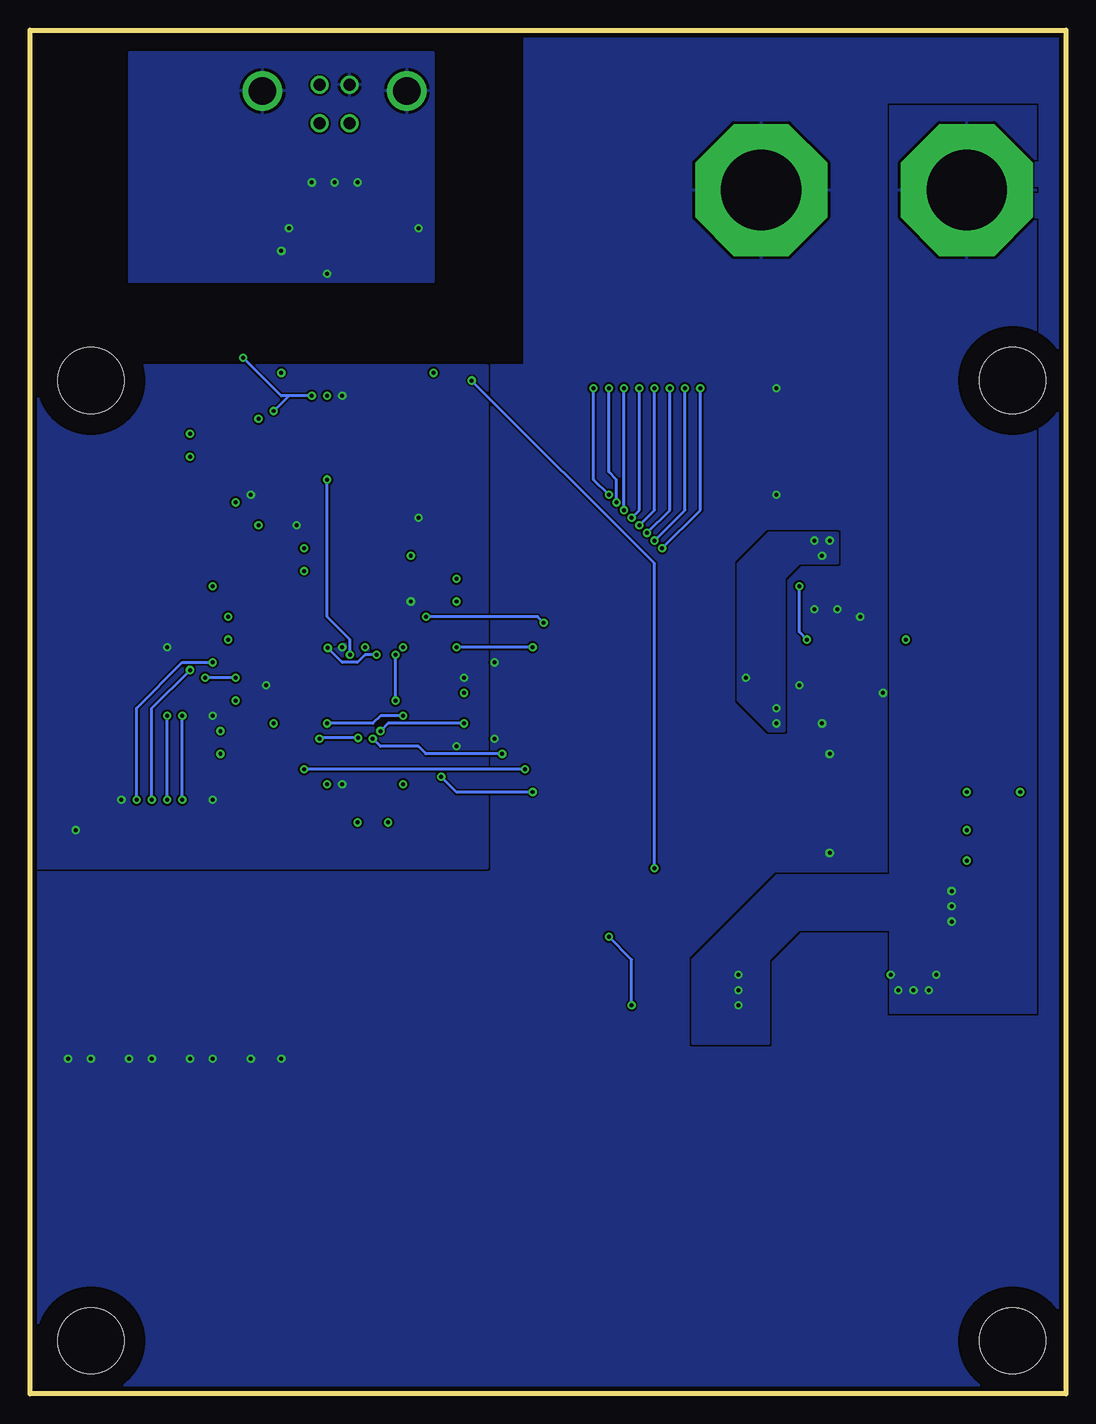
[diagram p3: board, bottom side, seen from below]

Size 86.36 x 113.67 mm. Coordinates in mm from the lower left corner, seen from the top.
Outline: 0,0 86.36,0 86.36,113.67 0,113.67 0,0
Copper layers (1*16): Top 0.0356mm / dielectric 1.5011mm / Bottom 0.0356mm
Design rules "OSH_PCB Rules": minimum track width 6mil, minimum drill 13mil, track to track 6mil, track to pad 6mil, pad to pad 6mil, via to via 6mil, smd to smd 6mil, copper to edge 15mil, drill to drill 6mil, minimum pad ring 7mil, minimum via ring 7mil, stop-mask expansion 3mil, vias tented up to drill 0mil, thermal gap 10mil

### Footprints (pad centres in the part's own frame; a part is rotated, then mirrored left to right if it is on the bottom)
CHIP-LED0805 = smd 1.2 x 1.2: A 0,-1.05; C 0,1.05
BANANA_SOCKET_VERT = drill 6.7 pad 11 octagon: P$1 0,0
C0603K = smd 1.05 x 1.08: 1 -0.875,0; 2 0.875,0
C1206 = smd 1.6 x 1.8: 1 -1.4,0; 2 1.4,0
SOD-128 = smd 2.4 x 2.1: ANODE -2.7,0; CATHODE 2.7,0
DPAK = smd 3 x 1.6: 1 4.25,-2.3; 3 4.25,2.3 | smd 6.7 x 6.7: 2 -2.4,0
CARCONTROLLER-REF = hole 5.5: -43.18,43.18; 33.655,43.18; 33.655,-36.83; -43.18,-36.83
SAMTEC-TFM-125-XX-X-D = smd 0.5 x 3: 1 -15.24,-2; 2 -15.24,2; 3 -13.97,-2; 4 -13.97,2; 5 -12.7,-2; 6 -12.7,2; 7 -11.43,-2; 8 -11.43,2; 9 -10.16,-2; 10 -10.16,2; 11 -8.89,-2; 12 -8.89,2; 13 -7.62,-2; 14 -7.62,2; 15 -6.35,-2; 16 -6.35,2; 17 -5.08,-2; 18 -5.08,2; 19 -3.81,-2; 20 -3.81,2; 21 -2.54,-2; 22 -2.54,2; 23 -1.27,-2; 24 -1.27,2; 25 0,-2; 26 0,2; 27 1.27,-2; 28 1.27,2; 29 2.54,-2; 30 2.54,2; 31 3.81,-2; 32 3.81,2; 33 5.08,-2; 34 5.08,2; 35 6.35,-2; 36 6.35,2; 37 7.62,-2; 38 7.62,2; 39 8.89,-2; 40 8.89,2; 41 10.16,-2; 42 10.16,2; 43 11.43,-2; 44 11.43,2; 45 12.7,-2; 46 12.7,2; 47 13.97,-2; 48 13.97,2; 49 15.24,-2; 50 15.24,2
TE-5787834-1 = drill 1: 1 1.25,2.705; 2 -1.25,2.705; 3 -1.25,-0.505; 4 1.25,-0.505 | drill 2.3: SH1 -6.02,0; SH2 6.02,0
0805 = smd 1 x 1.4: 1 -1,0; 2 1,0
0805' = smd 1.3 x 1.5: 1 -0.95,0; 2 0.95,0
WURTH-744325XXXX = smd 4.35 x 4: P$1 -4.075,0; P$2 4.075,0
R0603 = smd 1 x 1.1: 1 -0.85,0; 2 0.85,0
TE-FSM4JSMATR = smd 1.4 x 2.1: 1 2.25,4.55; 2 2.25,-4.55; 3 -2.25,4.55; 4 -2.25,-4.55
TP20R = smd 2 x 2: TP 0,0
TPS54540 = smd 0.6 x 2.15: 1 -1.905,-3; 2 -0.635,-3; 3 0.635,-3; 4 1.905,-3; 5 1.905,3; 6 0.635,3; 7 -0.635,3; 8 -1.905,3 | smd 3.1 x 2.4: PAD 0,0 | smd 4.9 x 2.95: PAD1 0,0
ADUM3160 = smd 0.55 x 2.625: 1 -4.445,-5; 2 -3.175,-5; 3 -1.905,-5; 4 -0.635,-5; 5 0.635,-5; 6 1.905,-5; 7 3.175,-5; 8 4.445,-5; 9 4.445,5; 10 3.175,5; 11 1.905,5; 12 0.635,5; 13 -0.635,5; 14 -1.905,5; 15 -3.175,5; 16 -4.445,5
SOT23-5 = smd 0.6 x 1.45: 1 -0.95,-1.55; 2 0,-1.55; 4 0.95,1.55; 5 -0.95,1.55 | smd 0.6 x 1.4: 3 0.95,-1.55
SOIC-16 = smd 0.6 x 1.55: 1 -4.445,-2.7; 2 -3.175,-2.7; 3 -1.905,-2.7; 4 -0.635,-2.7; 5 0.635,-2.7; 6 1.905,-2.7; 7 3.175,-2.7; 8 4.445,-2.7; 9 4.445,2.7; 10 3.175,2.7; 11 1.905,2.7; 12 0.635,2.7; 13 -0.635,2.7; 14 -1.905,2.7; 15 -3.175,2.7; 16 -4.445,2.7
PDS1-M = smd 1 x 2.1: 1 -3.81,-5.1; 2 -1.27,-5.1; 4 3.81,-5.1; 5 3.81,5.1; 8 -3.81,5.1
PQFP-64 = smd 2.1 x 0.3: 1 -5.85,3.75; 2 -5.85,3.25; 3 -5.85,2.75; 4 -5.85,2.25; 5 -5.85,1.75; 6 -5.85,1.25; 7 -5.85,0.75; 8 -5.85,0.25; 9 -5.85,-0.25; 10 -5.85,-0.75; 11 -5.85,-1.25; 12 -5.85,-1.75; 13 -5.85,-2.25; 14 -5.85,-2.75; 15 -5.85,-3.25; 16 -5.85,-3.75; 33 5.85,-3.75; 34 5.85,-3.25; 35 5.85,-2.75; 36 5.85,-2.25; 37 5.85,-1.75; 38 5.85,-1.25; 39 5.85,-0.75; 40 5.85,-0.25; 41 5.85,0.25; 42 5.85,0.75; 43 5.85,1.25; 44 5.85,1.75; 45 5.85,2.25; 46 5.85,2.75; 47 5.85,3.25; 48 5.85,3.75 | smd 0.3 x 2.1: 17 -3.75,-5.85; 18 -3.25,-5.85; 19 -2.75,-5.85; 20 -2.25,-5.85; 21 -1.75,-5.85; 22 -1.25,-5.85; 23 -0.75,-5.85; 24 -0.25,-5.85; 25 0.25,-5.85; 26 0.75,-5.85; 27 1.25,-5.85; 28 1.75,-5.85; 29 2.25,-5.85; 30 2.75,-5.85; 31 3.25,-5.85; 32 3.75,-5.85; 49 3.75,5.85; 50 3.25,5.85; 51 2.75,5.85; 52 2.25,5.85; 53 1.75,5.85; 54 1.25,5.85; 55 0.75,5.85; 56 0.25,5.85; 57 -0.25,5.85; 58 -0.75,5.85; 59 -1.25,5.85; 60 -1.75,5.85; 61 -2.25,5.85; 62 -2.75,5.85; 63 -3.25,5.85; 64 -3.75,5.85 | smd 2 x 0.2: MASK-1 -5.85,3.75; MASK-2 -5.85,3.25; MASK-3 -5.85,2.75; MASK-4 -5.85,2.25; MASK-5 -5.85,1.75; MASK-6 -5.85,1.25; MASK-7 -5.85,0.75; MASK-8 -5.85,0.25; MASK-9 -5.85,-0.25; MASK-10 -5.85,-0.75; MASK-11 -5.85,-1.25; MASK-12 -5.85,-1.75; MASK-13 -5.85,-2.25; MASK-14 -5.85,-2.75; MASK-15 -5.85,-3.25; MASK-16 -5.85,-3.75; MASK-33 5.85,-3.75; MASK-34 5.85,-3.25; MASK-35 5.85,-2.75; MASK-36 5.85,-2.25; MASK-37 5.85,-1.75; MASK-38 5.85,-1.25; MASK-39 5.85,-0.75; MASK-40 5.85,-0.25; MASK-41 5.85,0.25; MASK-42 5.85,0.75; MASK-43 5.85,1.25; MASK-44 5.85,1.75; MASK-45 5.85,2.25; MASK-46 5.85,2.75; MASK-47 5.85,3.25; MASK-48 5.85,3.75 | smd 0.2 x 2: MASK-17 -3.75,-5.85; MASK-18 -3.25,-5.85; MASK-19 -2.75,-5.85; MASK-20 -2.25,-5.85; MASK-21 -1.75,-5.85; MASK-22 -1.25,-5.85; MASK-23 -0.75,-5.85; MASK-24 -0.25,-5.85; MASK-25 0.25,-5.85; MASK-26 0.75,-5.85; MASK-27 1.25,-5.85; MASK-28 1.75,-5.85; MASK-29 2.25,-5.85; MASK-30 2.75,-5.85; MASK-31 3.25,-5.85; MASK-32 3.75,-5.85; MASK-49 3.75,5.85; MASK-50 3.25,5.85; MASK-51 2.75,5.85; MASK-52 2.25,5.85; MASK-53 1.75,5.85; MASK-54 1.25,5.85; MASK-55 0.75,5.85; MASK-56 0.25,5.85; MASK-57 -0.25,5.85; MASK-58 -0.75,5.85; MASK-59 -1.25,5.85; MASK-60 -1.75,5.85; MASK-61 -2.25,5.85; MASK-62 -2.75,5.85; MASK-63 -3.25,5.85; MASK-64 -3.75,5.85
D8 = smd 1.981 x 0.559: 1 -2.464,1.905; 2 -2.464,0.635; 3 -2.464,-0.635; 4 -2.464,-1.905; 5 2.464,-1.905; 6 2.464,-0.635; 7 2.464,0.635; 8 2.464,1.905
CX3225GB = smd 1.3 x 1.05: 1 -1.15,-0.925; 2 1.15,-0.925; 3 1.15,0.925; 4 -1.15,0.925

### Placement (x,y rotation side)
ARX  67.94,30.48 180 top
ATX  65.41,30.48 180 top
B1  8.26,100.33 0 top
B2  25.4,100.33 0 top
BRX  73.03,30.48 180 top
BTX  71.12,30.48 180 top
C40  25.4,55.24 270 top
C42  14.61,61.59 180 top
C43  38.1,48.26 0 top
C44  62.87,99.06 90 top
C45  59.05,99.06 90 top
C46  52.7,66.04 180 top
C47  60.96,99.06 90 top
C48  71.12,82.55 180 top
C49  62.87,80.64 270 top
C50  67.94,62.87 0 top
C51  67.94,64.77 0 top
C52  49.53,54.61 180 top
C53  67.31,57.78 0 top
C54  68.58,55.24 0 top
C55  59.05,49.53 270 top
C56  49.53,60.96 180 top
C57  68.58,53.34 0 top
C58  56.52,49.53 270 top
C59  52.7,67.94 180 top
C60  69.22,67.31 0 top
C61  69.22,72.39 180 top
C62  82.55,45.09 270 top
C63  56.52,71.12 180 top
C64  56.52,69.22 180 top
C65  61.59,70.48 0 top
C66  61.59,68.58 0 top
C67  64.77,99.06 270 top
C68  71.12,80.01 0 top
C69  71.12,78.11 0 top
C70  27.3,55.24 270 top
C73  38.73,35.56 0 top
C74  38.73,30.48 0 top
C75  24.77,33.02 180 top
C76  38.73,34.29 0 top
C85  14.61,59.69 180 top
C86  11.43,50.8 90 top
C87  11.43,46.99 180 top
C88  11.43,44.45 180 top
C89  17.14,67.94 270 top
C90  19.05,67.94 270 top
C91  20.95,67.94 270 top
CRX  78.11,30.48 180 top
CTX  76.2,30.48 180 top
D5  12.7,38.1 90 top
D21  5.71,57.15 270 top
DRX  83.19,30.48 180 top
DTX  81.28,30.48 180 top
H2  47.62,41.27 0 top
H4  38.1,79.38 0 top
J2  60.96,108.58 180 top
L2  55.88,73.03 0 top
L3  62.23,72.39 180 top
L4  66.67,99.06 270 top
L5  2.2uH  [0805']  31.11,59.69 270 top
L7  8.89,69.22 0 top
LED2  29.21,55.24 180 top
LED12  71.12,76.2 270 top
R7  71.12,74.3 0 top
R33  57.15,99.06 270 top
R34  55.24,99.06 270 top
R35  62.23,74.93 180 top
R36  31.11,53.34 90 top
R37  65.41,34.29 270 top
R38  67.94,34.29 270 top
R39  71.12,34.29 270 top
R40  73.03,34.29 270 top
R41  76.2,34.29 270 top
R42  19.68,51.44 270 top
R44  78.11,34.29 270 top
R45  81.28,34.29 270 top
R46  83.19,34.29 270 top
R47  74.93,60.33 90 top
R48  41.91,63.5 180 top
R49  17.14,60.33 270 top
R54  41.91,61.59 180 top
R55  41.91,59.69 180 top
R56  41.91,57.78 180 top
R57  41.91,55.88 180 top
R58  41.91,53.98 180 top
R59  41.91,52.07 180 top
R60  41.91,50.16 180 top
R61  24.77,34.92 0 top
R62  20.32,60.96 90 top
R63  38.73,32.38 0 top
R65  24.77,30.48 0 top
R68  20.32,57.78 90 top
R72  17.14,46.99 270 top
R73  19.68,46.99 90 top
S2  52.7,34.29 180 top
TP26  31.11,38.1 90 top
TP27  36.2,38.1 0 top
TP28  33.66,38.1 0 top
U9  15.88,53.98 0 top
U14  58.42,90.17 180 top
U16  26.67,59.05 270 top
U21  31.11,43.81 180 top
U22  70.48,90.17 270 top
U28  58.42,58.42 270 top
U29  75.56,45.09 0 top
U30  67.31,78.11 180 top
U49  31.75,33.66 180 top
Y2  69.22,69.85 180 top

### Tracks (layer width: path | path; a pad name or v marks a point on that pad's centre or on a via)
5VREG_EN
  Top 0.254: U9.3 16.51,48.48 R72.1 R73.2
!POR  (via drill 0.33 pad 0.25)
  Top 0.254: TP28.TP 33.66,38.73 34.29,39.37 U21.15 v34.29,43.81 | v49.53,84.45 H4.44
  Bottom 0.254: v34.29,43.81 34.29,69.22 v49.53,84.45
!PWREN!  (via drill 0.33, 0.33 pad 0.25)
  Top 0.254: R47.1 74.93,57.78 v74.93,56.52 v71.75,59.69 | U28.MASK-60 68.73,60.17 v69.22,59.69 | U29.13 v74.93,49.53
  Bottom 0.254: v69.22,59.69 v71.75,59.69 | v74.93,49.53 v74.93,56.52
+3V3
  pour Top: 26.67,55.24 26.67,57.15 27.3,57.15 27.3,59.05 29.84,59.05 30.48,59.69 32.38,59.69 32.38,57.15 30.48,57.15 30.48,55.24
  pour Top: 37.47,52.7 32.38,57.78 28.57,57.78 28.57,55.24 31.75,55.24 34.92,52.07 34.92,44.45 37.47,44.45
+5V  (via drill 0.33 pad 0.25)
  Top 0.254: C90.1 C91.1 | 22.23,67.94 21.35,68.82 C91.1 | R62.2 20.54,61.81 v21.59,62.87 | v22.23,67.31 22.23,68.58 21.98,68.82 C91.1
  Bottom 0.254: v21.59,62.87 22.23,63.5 v22.23,67.31
  other vias: 26.67,59.69 24.13,57.15 24.13,55.88 20.32,69.85 19.68,71.12 20.95,71.12
  pour Top (rank 3): 8.26,73.03 8.26,67.94 9.53,66.67 15.24,66.67 16.51,67.94 22.23,67.94 22.23,71.75 23.5,73.03 23.5,83.82 19.05,83.82
  pour Top (rank 2): 27.3,60.96 27.3,55.24 23.5,55.24 23.5,60.96
  pour Bottom: 19.05,69.22 22.23,69.22 23.5,67.94 23.5,55.24 24.77,55.24 27.3,57.78 27.3,69.22 24.77,71.75 19.05,71.75
+5V/1  (via drill 0.33 pad 0.25)
  Top 0.254: v68.58,86.36 U22.5 75.58,83.84 74.3,82.55 C48.1 | U14.16 v62.87,83.19 C49.1 | v66.04,81.92 66.36,81.59 U30.3 66.36,78.42 66.67,78.11 67.94,78.11 68.26,78.42 U30.1 68.61,80.01 C68.1
  Bottom 0.254: v62.87,83.19 64.77,83.19 | 64.77,83.19 65.41,83.19 v68.58,86.36 | v66.04,81.92 64.77,83.19
BOOT_5V
  Top 0.254: U9.1 12.92,49.92 C86.1
COMP_5V
  Top 0.254: U9.6 16.51,58.84 R49.2 15.7,59.48 C85.1
EECLK  (via drill 0.33, 0.33 pad 0.25)
  Top 0.254: v71.12,60.96 70.91,61.17 U28.MASK-62 | U29.11 v77.47,49.53
  Bottom 0.254: v71.12,60.96 73.66,60.96 77.47,57.15 v77.47,49.53
EECS  (via drill 0.33, 0.33 pad 0.25)
  Top 0.254: v73.03,60.33 71.68,61.67 U28.MASK-63 | U29.12 v76.2,49.53
  Bottom 0.254: v73.03,60.33 76.2,57.15 v76.2,49.53
EEDATA  (via drill 0.33 pad 0.25)
  Top 0.254: U28.MASK-61 69.5,60.67 73.03,57.15 v73.66,56.52 | U29.14 v73.66,49.53
  Bottom 0.254: v73.66,49.53 v73.66,56.52
FB_5V
  Top 0.254: U9.5 19.44,58.63 R68.2 R62.1
GND  (via drill 0.33, 0.33 pad 0.25)
  Top 0.254: DRX.C v83.19,27.94 | DTX.C v81.28,27.94 | CRX.C v78.11,27.94 | CTX.C v76.2,27.94 | BRX.C v73.03,27.94 | BTX.C v71.12,27.94 | ARX.C v67.94,27.94 | ATX.C v65.41,27.94 | U29.8 80.17,42.38 80.17,41.75 80.64,41.27 81.92,41.27 82.55,41.91 C62.2 | R7.1 v69.22,74.3 | C69.2 v73.03,78.11 | C68.2 v73.03,80.01 | U30.2 v67.31,81.28 | C52.2 v47.62,54.61 | C58.2 v56.52,47.62 | C55.2 v59.05,47.62 | C54.2 v70.48,55.24 | C57.2 v70.48,53.34 | C53.2 v69.22,57.78 | C59.2 v50.8,67.94 | U14.9 52.78,85.17 v52.7,85.09 | U14.15 v61.59,83.19 | U22.4 65.39,85.11 v65.41,85.09 | C63.2 C64.2 55.24,69.22 v54.61,69.85 | v63.5,68.58 C66.2 C65.2 v63.5,70.48 | C46.2 v50.8,66.04 | C50.2 v69.85,62.87 | C51.2 v69.85,64.77 | C87.2 v8.26,46.99 | C88.2 v8.26,44.45 | R73.1 v19.68,45.09 | R68.1 v20.32,55.88 | U9.7 v15.24,58.42 15,58.42 C85.2 C42.2 13.34,61.35 v13.34,62.87 | D21.1 3.42,50.56 v3.81,50.16 | D21.3 8.02,50.41 v8.26,50.16 | R42.1 v19.68,53.34 | C61.2 v67.31,72.39 | C60.2 v71.12,67.31 | H4.3 v24.13,74.93 | H4.4 v24.13,83.82 | U28.MASK-11 57.15,64.25 57.15,62.87 57.78,62.23 v58.42,62.23 | C90.2 C91.2 | U28.MASK-15 55.17,62.3 v55.24,62.23 55.88,62.23 56.17,62.52 U28.MASK-13 | U28.MASK-35 55.67,51.23 v55.24,50.8 | U28.MASK-51 65.83,55.67 v66.04,55.88 | U28.MASK-5 60.17,63.02 60.33,62.87 v60.33,62.23 | C56.2 v47.62,60.96 | U28.MASK-47 61.67,50.88 v61.59,50.8 | U28.MASK-25 50.41,58.17 v50.16,58.42
  Top 0.406: U16.2 v22.23,59.05
  other vias: 17.14,64.77 19.05,65.41 20.95,65.41
  pour Top (rank 5): 90.81,-4.45 90.81,85.72 45.09,85.72 45.09,115.57 -5.08,115.57 -5.08,-4.45
  pour Bottom (rank 3): 45.09,114.94 -3.17,114.94 -3.17,-3.17 88.27,-3.17 88.27,85.72 45.09,85.72
MAN_RESET_SIGNAL  (via drill 0.33 pad 0.25)
  Top 0.254: 36.2,33.66 35.56,33.02 U49.2 33.02,33.02 28.57,28.57 24.77,28.57 23.91,29.43 R65.1 | R63.1 37.88,34.27 C76.1 36.83,34.29 36.2,33.66 | 36.2,33.66 v36.2,32.38 | v38.1,38.1 TP27.TP
  Bottom 0.254: v36.2,32.38 36.2,36.2 v38.1,38.1
N$1
  pour Bottom: 8.89,38.73 8.89,43.18 10.79,43.18
N$2  (via drill 0.33 pad 0.25)
  other vias: 10.79,34.92 11.43,33.66 12.7,33.66 13.97,33.66 14.61,34.92
  pour Bottom: 14.61,107.31 2.54,107.31 2.54,31.75 14.61,31.75
  pour Top: 8.89,37.47 16.51,37.47 16.51,33.66 14.61,31.75 10.79,31.75 8.89,33.66
N$4
  Top 0.254: LED12.C 72.17,74.5 R7.2
N$17
  Top 0.254: C42.1 15.7,61.17 R49.1
N$32
  Top 0.254: U29.3 73.66,40.64 73.03,40.01 R40.1
N$47
  Top 0.254: U29.4 74.93,41.27 76.2,40.01 R41.1
N$49
  Top 0.254: U29.2 72.39,41.27 71.12,40.01 R39.1
N$50
  Top 0.254: R38.1 67.94,38.58 71.12,41.75 U29.1
N$52
  Top 0.254: U29.15 72.39,46.35 65.41,39.37 R37.1
N$55
  Top 0.254: U29.5 76.2,41.27 78.11,39.37 R44.1
N$56
  Top 0.254: LED2.C R36.2
N$57
  Top 0.254: U16.5 29.52,60.01 29.84,60.33 31.43,60.33 | 31.75,60.33 31.43,60.33 | 31.43,60.33 L5.1
N$60
  Top 0.254: U21.14 33.02,40.01 TP26.TP 29.21,36.2 | 29.21,36.2 29.21,35.64 U49.5 | R61.1 23.91,36.62 24.13,36.83 28.57,36.83 29.21,36.2
N$61
  Top 0.254: 77.47,41.91 U29.6 77.47,41.27 81.28,37.47 R45.1
N$62
  Top 0.254: R46.1 83.19,35.4 | 83.19,35.56 R46.1 | U29.7 78.74,41.27 83.19,36.83 R46.1
N$63
  Top 0.254: R37.2 ATX.A
N$64
  Top 0.254: ARX.A R38.2
N$65
  Top 0.254: BTX.A R39.2
N$66
  Top 0.254: BRX.A R40.2
N$67
  Top 0.254: CTX.A R41.2
N$68
  Top 0.254: CRX.A R44.2
N$69
  Top 0.254: DTX.A R45.2
N$70
  Top 0.254: DRX.A R46.2
N$71
  Top 0.254: J2.1 59.71,105.39 61.59,102.23 64.5,102.23 65.27,101.47 | 65.27,101.47 L4.1 | C67.1 64.77,100.97 65.27,101.47
N$72
  Top 0.254: U49.1 34.21,31.19 34.92,30.48 C74.1
N$73
  Top 0.254: U49.3 35.56,34.29 36.83,35.56 C73.1
N$74
  Top 0.254: 48.26,32.38 50.45,30.19 S2.1 | R63.2 48.26,32.38 | 48.26,32.38 50.45,34.58 S2.2
OSCI
  Top 0.254: Y2.3 68.34,68.65 C60.1 65.41,67.31 64.14,66.04 62.23,66.04 61.67,65.48 U28.MASK-2
OSCO
  Top 0.254: U28.MASK-3 61.17,66.25 61.59,66.67 64.14,66.67 67.31,69.85 69.44,69.85 Y2.1 70.36,72.11 C61.1
REF  (via drill 0.33, 0.33 pad 0.25)
  Top 0.254: U28.MASK-6 59.69,64.25 v59.69,61.59 | v61.59,76.2 61.38,75.98 R35.2
  Bottom 0.254: v59.69,61.59 59.69,62.87 61.59,64.77 v61.59,76.2
RT_5V
  Top 0.254: U9.4 19.3,50.98 R42.2
RXD_A  (via drill 0.33 pad 0.25)
  Top 0.254: R54.1 43.4,62.23 v44.45,62.23 | 53.34,62.23 53.28,62.17 U28.MASK-17 52.51,62.23 v50.8,62.23
  Bottom 0.254: v44.45,62.23 v50.8,62.23
RXD_B
  Top 0.254: R56.1 43.38,57.17 U28.MASK-27
RXD_C  (via drill 0.33)
  Top 0.254: U28.MASK-39 57.67,54.49 v57.78,54.61 | R58.1 46.35,53.98 v46.99,53.34
  Bottom 0.254: v46.99,53.34 53.34,53.34 53.98,53.98 57.15,53.98 v57.78,54.61
RXD_D  (via drill 0.33, 0.33 pad 0.25)
  Top 0.254: v55.24,56.52 55.24,55.24 53.98,53.98 53.98,53.34 v52.07,51.44 | v61.59,55.88 61.88,56.17 U28.MASK-52 | R60.1 v44.45,50.16
  Bottom 0.254: v55.24,56.52 57.15,56.52 57.78,55.88 v61.59,55.88 | v44.45,50.16 50.8,50.16 v52.07,51.44
SW_5V
  Top 0.254: C86.2 11.43,57.15 13.79,57.15 U9.8
  pour Top: 1.91,73.03 8.26,73.03 8.26,67.31 12.7,62.87 12.7,59.69 13.97,58.42 13.97,55.88 12.7,55.88 12.06,55.24 1.91,55.24
TXD_A  (via drill 0.33)
  Top 0.254: R48.1 v43.53,64.27 | v53.34,64.77 53.84,64.27 U28.MASK-16
  Bottom 0.254: v43.53,64.27 44.03,64.77 v53.34,64.77
TXD_B
  Top 0.254: R55.1 44.78,57.67 U28.MASK-26
TXD_C  (via drill 0.33)
  Top 0.254: R57.1 v50.16,55.88 | v57.15,55.24 57.15,52.59 U28.MASK-38
  Bottom 0.254: v50.16,55.88 56.52,55.88 v57.15,55.24
TXD_D  (via drill 0.33)
  Top 0.254: R59.1 v45.09,52.07 | v63.5,52.07 62.67,52.07 U28.MASK-48
  Bottom 0.254: v45.09,52.07 v63.5,52.07
UART_RX1  (via drill 0.33 pad 0.25)
  Top 0.254: R48.2 38.73,63.5 38.1,64.14 v38.1,74.93 | v39.37,83.82 H4.28
  Bottom 0.254: v39.37,83.82 39.37,76.2 v38.1,74.93
UART_RX2  (via drill 0.33)
  Top 0.254: R55.2 40.01,59.69 36.83,62.87 v36.83,73.66 | v36.83,83.82 H4.24 36.83,80.64
  Bottom 0.254: v36.83,73.66 v36.83,83.82
UART_RX3  (via drill 0.33)
  Top 0.254: R57.2 35.56,61.38 v35.56,72.39 | v34.29,83.82 H4.20
  Bottom 0.254: v34.29,83.82 34.29,73.66 v35.56,72.39
UART_RX4  (via drill 0.33)
  Top 0.254: R59.2 34.29,58.84 v34.29,71.12 | v31.75,83.82 H4.16
  Bottom 0.254: v31.75,83.82 31.75,73.66 v34.29,71.12
UART_TX1  (via drill 0.33 pad 0.25)
  Top 0.254: R54.2 39.37,61.59 37.47,63.5 v37.47,74.3 | v38.1,83.82 H4.26
  Bottom 0.254: v37.47,74.3 37.47,76.2 38.1,76.83 v38.1,83.82
UART_TX2  (via drill 0.33)
  Top 0.254: R56.2 36.2,62.65 v36.2,73.03 | v35.56,83.82 H4.22
  Bottom 0.254: v36.2,73.03 35.56,73.66 v35.56,83.82
UART_TX3  (via drill 0.33)
  Top 0.254: R58.2 34.92,60.11 v34.92,71.75 | v33.02,83.82 H4.18
  Bottom 0.254: v33.02,83.82 33.02,73.66 v34.92,71.75
UART_TX4  (via drill 0.33)
  Top 0.254: R60.2 33.66,57.57 v33.66,70.48 | v30.48,83.82 H4.14
  Bottom 0.254: v30.48,83.82 30.48,73.66 v33.66,70.48
UD_N
  Top 0.254: R33.2 56.13,97.19 56.13,96.52 56.52,96.14 U14.6
UD_P
  Top 0.254: R34.2 55.63,97.83 55.63,96.52 55.24,96.14 U14.7
USB_D_N
  Top 0.254: U14.11 56.52,83.54 59.31,80.75 59.31,66.04 59.17,65.9 U28.MASK-7
USB_D_P
  Top 0.254: U14.10 55.24,84.1 58.8,80.54 58.8,66.67 58.67,66.54 U28.MASK-8
USBISO_D_N
  Top 0.254: J2.2 62.21,106.45 61.59,107.06 59.16,107.06 56.13,104.03 56.13,100.93 R33.1 57.15,99.95
USBISO_D_P
  Top 0.254: J2.3 62.21,108.18 61.59,107.57 58.95,107.57 55.63,104.25 55.63,100.29 R34.1 55.46,99.91
USBISO_GND  (via drill 0.33)
  Top 0.254: C67.2 v64.77,97.16 | U14.2 v61.59,93.34 | U22.1 65.39,95.23 v65.41,95.25 | U14.8 v53.98,97.16 | C45.2 v59.05,100.97 | C47.2 v60.96,100.97 | C44.2 v62.87,100.97
  pour Bottom: 52.7,111.76 78.11,111.76 78.11,92.71 52.7,92.71
  pour Top: 52.7,111.76 52.7,92.71 78.11,92.71 78.11,111.76
USBISO_VCC
  Top 0.254: C44.1 C47.1 | L4.2 66.67,97.79 65.41,96.52 64.22,96.52 U14.1 62.87,92.08 63.5,91.44 U22.2
  Top 0.406: U14.1 C44.1 | L4.2 66.94,97.79
VCC  (via drill 0.33 pad 0.25)
  Top 0.254: C87.1 12.7,46.86 12.7,44.32 | C88.1 12.7,44.32 | 12.7,44.32 12.7,43.81
  other vias: 9.53,41.91 9.53,40.64 9.53,39.37 27.3,34.92 27.3,33.66 27.3,32.38
  pour Top: 11.43,52.7 18.41,52.7 18.41,38.73 8.89,38.73 8.89,42.55 12.06,42.55 11.43,43.18
  pour Bottom: 16.51,38.73 8.89,38.73 8.89,43.18 24.13,43.18 31.11,36.2 31.11,29.21 24.77,29.21 24.77,36.2 22.23,38.73
  pour Top: 24.77,36.2 31.11,36.2 31.11,31.75 31.11,31.11 28.57,28.57 24.77,28.57
VCCIO  (via drill 0.33, 0.33 pad 0.25)
  Top 0.254: C62.1 v82.55,46.99 | U29.10 v78.74,49.53 | U29.16 v71.12,49.53 | U30.5 69.72,76.56 LED12.A | U30.5 69.5,76.56 69.85,76.2 69.85,77.71 C69.1 | C56.1 50.7,60.67 U28.MASK-20 50.45,60.67 50.16,60.96 v50.16,59.69 | U28.MASK-31 50.97,55.17 C52.1 50.16,54.61 v50.8,53.98 | C55.1 59.17,50.52 U28.MASK-42 59.17,50.91 59.05,50.8 v60.33,50.8 | C53.1 66.67,57.78 | C53.1 66.04,57.78 | U28.MASK-56 66.05,58.17 C53.1 | U28.MASK-14 55.67,65.86 55.48,66.04 v54.61,66.04 C46.1 | L3.1 v64.14,72.39 | L2.1 v53.98,73.03 | U14.12 U14.13 U14.14 v60.33,83.19 | U30.5 68.26,75.25 v67.94,74.93 | 67.94,55.24 67.87,55.17 U28.MASK-50 67.63,55.17 C54.1 67.94,55.48 67.94,55.88 68.58,56.52 v71.12,56.52 | C53.1 66.44,58.81 v66.67,59.05 | R47.2 v74.93,62.23
  pour Bottom (rank 2): 89.53,85.72 48.26,85.72 48.26,43.81 89.53,43.81
VCORE  (via drill 0.33, 0.33 pad 0.25)
  Top 0.254: C58.1 56.67,50.56 U28.MASK-37 56.67,54.45 55.88,55.24 | U28.MASK-64 64.33,62.23 66.04,62.23 | 66.04,62.23 66.67,62.87 C50.1 | C51.1 C50.1 | U28.MASK-64 65.98,62.17 66.04,62.23 | C50.1 67.31,62.87 | 56.67,62.38 U28.MASK-12 56.67,66.76 55.48,67.94 C59.1 | U28.MASK-64 v61.53,62.17 | v58.99,54.67 57.78,55.88 56.52,55.88 55.88,55.24 | 55.88,55.24 v55.88,57.78 | v55.88,61.59 56.67,62.38 | v57.46,61.59 56.67,62.38 | v62.23,54.61 62.29,54.67 U28.MASK-49 65.6,53.34 C57.1
  Bottom 0.254: v55.88,57.78 v55.88,61.59 | v57.46,61.59 58.42,61.59 59.05,60.96 60.33,60.96 v61.53,62.17 | v58.99,54.67 62.17,54.67 v62.23,54.61
VDD1
  Top 0.254: C45.1 U14.4 | U14.4 U14.5 | U14.4 U14.3
VPHY
  Top 0.254: U28.MASK-4 60.72,64.32 C66.1 C65.1 61.23,71 L3.2
VPLL
  Top 0.254: 56.91,72.9 L2.2 57.39,72.52 C63.1 C64.1 | 57.15,68.97 C64.1 | C64.1 57.39,66.44 58.17,65.66 U28.MASK-9

### Text on the board
tPlace: + | -
tNames: V1.0 / Bench Power Card / Formula Electric / Missouri S&T